# EAGLE design untitled (EAGLE 9.5.2)
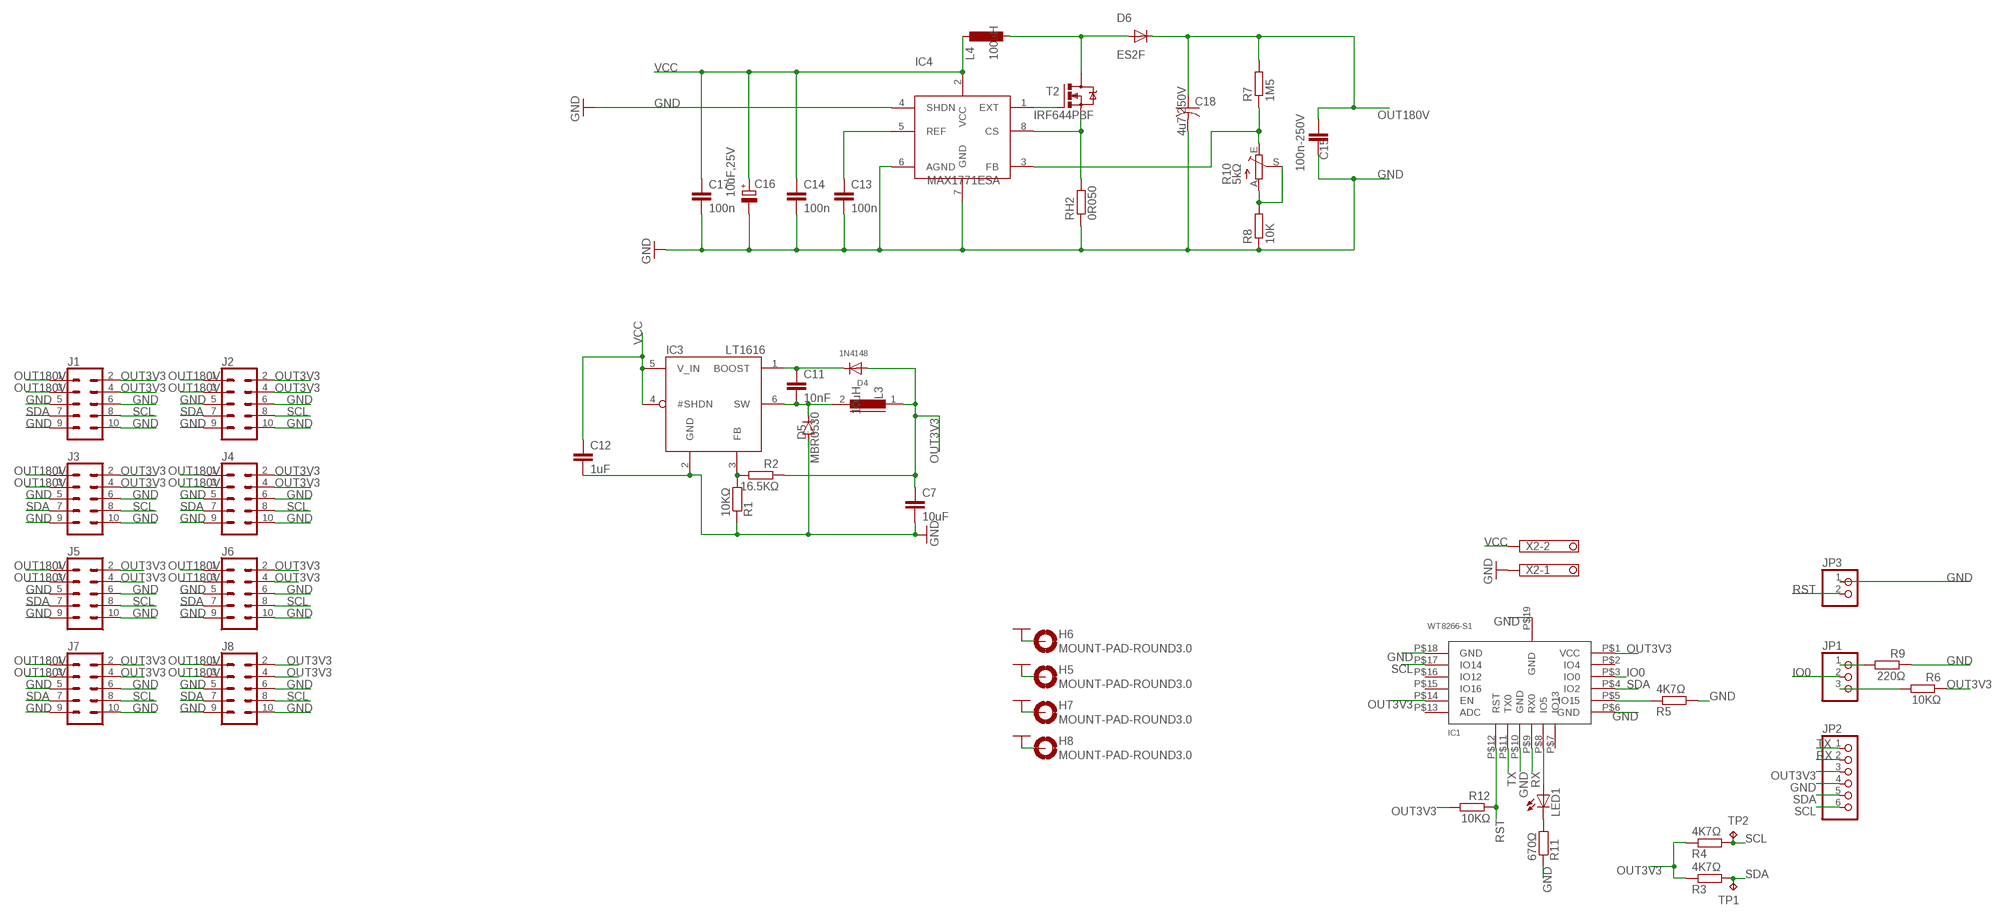
[diagram p0: schematic, sheet 1]

## Parts
C7  10uF  C-EUC1206  [C1206]
C11  10nF  C-EUC1206  [C1206]
C12  1uF  C-EUC1206  [C1206]
C13  100n  C-EUC1206  [C1206]
C14  100n  C-EUC1206  [C1206]
C15  100n-250V  C-EU-2420  [C2420]
C16  10uF,25V  C-POL-EU7343  [C-EIA-7343]
C17  100n  C-EUC1206  [C1206]
C18  4u7 250V  ECA-1EM102  [CAP_RADIAL_5MM]
D4  1N4148  DIODEDO-1N4148  [DO-1N4148]
D5  MBR0530  DIODE-SOD123  [SOD123]
D6  ES2F  DIODE-SMC  [SMC]
H5  MOUNT-PAD-ROUND3.0  [3,0-PAD]
H6  MOUNT-PAD-ROUND3.0  [3,0-PAD]
H7  MOUNT-PAD-ROUND3.0  [3,0-PAD]
H8  MOUNT-PAD-ROUND3.0  [3,0-PAD]
IC1  WT8266-S1  [WT8266-S1]
IC3  LT1616  [SOT23-6]
IC4  MAX1771ESA  [SO-8]
J1  CONN_05X2PTH  [2X5]
J2  CONN_05X2PTH  [2X5]
J3  CONN_05X2PTH  [2X5]
J4  CONN_05X2PTH  [2X5]
J5  CONN_05X2PTH  [2X5]
J6  CONN_05X2PTH  [2X5]
J7  CONN_05X2PTH  [2X5]
J8  CONN_05X2PTH  [2X5]
JP1  PINHD-1X3  [1X03]
JP2  PINHD-1X6  [1X06]
JP3  PINHD-1X2  [1X02]
L3  10uH  82114R  [82114R]
L4  100uH  L-EUTJ3-U1  [TJ3-U1]
LED1  LED3MM  [LED3MM]
R1  10KΩ  R-EU_R1206  [R1206]
R2  16.5KΩ  R-EU_R0805  [R0805]
R3  4K7Ω  R-EU_R1206  [R1206]
R4  4K7Ω  R-EU_R1206  [R1206]
R5  4K7Ω  R-EU_R1206  [R1206]
R6  10KΩ  R-EU_R1206  [R1206]
R7  1M5  R-EU_R2512  [R2512]
R8  10K  R-EU_R1206  [R1206]
R9  220Ω  R-EU_R1206  [R1206]
R10  5kΩ  TRIM_EU-RS3  [RS3]
R11  670Ω  R-EU_R1206  [R1206]
R12  10KΩ  R-EU_R1206  [R1206]
RH2  0R050  R-EU_R2512  [R2512]
T2  IRF644PBF  IRF740  [TO220BV]
TP1  TPTP18R  [TP18R]
TP2  TPTP18R  [TP18R]
X2  TERMINAL-BLOCK-3.5MM-2-PIN-LONG-PAD  [TERMINAL-BLOCK-2-PIN-3.5MM-LONG-PAD]

## Nets
EXT1: IC4.1(EXT) T2.G
GND: C7.2 C12.2 C13.2 C14.2 C15.P$2 C16.- C17.2 C18.2 D5.A H5.B3,0(MOUNT) H6.B3,0(MOUNT) H7.B3,0(MOUNT) H8.B3,0(MOUNT) IC1.P$6(GND) IC1.P$10(GND) IC1.P$18(GND) IC1.P$19(GND) IC3.2(GND) IC4.4(SHDN) IC4.6(AGND) IC4.7(GND) J1.5 J1.6 J1.9 J1.10 J2.5 J2.6 J2.9 J2.10 J3.5 J3.6 J3.9 J3.10 J4.5 J4.6 J4.9 J4.10 J5.5 J5.6 J5.9 J5.10 J6.5 J6.6 J6.9 J6.10 J7.5 J7.6 J7.9 J7.10 J8.5 J8.6 J8.9 J8.10 JP2.4 JP3.1 R1.1 R5.2 R8.1 R9.1 R11.1 RH2.1 X2.1
IO0: IC1.P$3(IO0) JP1.2
N$1: IC3.3(FB) R1.2 R2.2
N$2: IC1.P$5(IO15) R5.1
N$3: JP1.1 R9.2
N$4: C11.2 D5.C IC3.6(SW) L3.2
N$5: C11.1 D4.C IC3.1(BOOST)
N$6: IC4.3(FB) R7.1 R10.E
N$7 [power]: D6.A L4.2 T2.D
N$8: JP1.3 R6.2
N$9: C13.1 IC4.5(REF)
N$10: R8.2 R10.A R10.S
N$11: IC4.8(CS) RH2.2 T2.S
N$12: IC1.P$8(IO5) LED1.A
N$13: LED1.K(C) R11.2
OUT3V3: C7.1 D4.A IC1.P$1(VCC) IC1.P$14(EN) J1.2 J1.4 J2.2 J2.4 J3.2 J3.4 J4.2 J4.4 J5.2 J5.4 J6.2 J6.4 J7.2 J7.4 J8.2 J8.4 JP2.3 L3.1 R2.1 R3.1 R4.1 R6.1 R12.2
OUT180V [power]: C15.P$1 C18.1 D6.C J1.1 J1.3 J2.1 J2.3 J3.1 J3.3 J4.1 J4.3 J5.1 J5.3 J6.1 J6.3 J7.1 J7.3 J8.1 J8.3 R7.2
RST: IC1.P$12(RST) JP3.2 R12.1
RX: IC1.P$9(RX0) JP2.2
SCL: IC1.P$17(IO14) J1.8 J2.8 J3.8 J4.8 J5.8 J6.8 J7.8 J8.8 JP2.6 R4.2 TP2.TP
SDA: IC1.P$4(IO2) J1.7 J2.7 J3.7 J4.7 J5.7 J6.7 J7.7 J8.7 JP2.5 R3.2 TP1.TP
TX: IC1.P$11(TX0) JP2.1
VCC: C12.1 C14.1 C16.+ C17.1 IC3.4(#SHDN) IC3.5(V_IN) IC4.2(VCC) L4.1 X2.2
Unconnected: IC1.P$2(IO4) IC1.P$7(IO13) IC1.P$13(ADC) IC1.P$15(IO16) IC1.P$16(IO12)

## Library data of the parts
C7 C11-C14 C17 = resistor:C-EU: CAPACITOR, European symbol
C15 = nick:C-EU
C16 = nick:C-POL-EU7343: Capacitor, Tantalum, EU 7343 case, polarised
C18 = Resistor_Capacitor:ECA-1EM102: CAP ALUM 1000UF 20% 25V RADIAL Manufacturer's datasheet <https://media.digikey.com/pdf/Data%20Sheets/Panasonic%20Electronic%20Components/ECA-xxM%20Series,TypeA.pdf>; CREATED_BY: PCBLayout.com; DIGIKEY_PART_NUMBER: P5156-ND; MANUFACTURER: Panasonic Electronic Components; MPN: ECA-1EM102; PACKAGE: CAP RADIAL 5MM LS
D4 = adafruit:DIODE: Diode SMADIODE - SMA Surface Mount Package 20V 1A Schottky Diode Digikey: 641-1014-6-ND DO-1N4148 - Through Hole Small Current Diode SOD-123 20V 1 A (.5mV Vf) Schottky Diode - Digikey: MBRX120TPMSCT-ND SOD-323 10V 570mA (.38mV Vf, 3ns) Schottky Diode - Digikey: ZLLS410CT-ND SOD-523 30V 30mA Schottky Diode (RB751S-40TE61) - Digikey: RB751S-40TE61CT-ND SOT23-R/W - SOT23 Package (R = Solder Paste/Reflow Ovens, W = Hand-Soldering) BAT54Film 40V 300mA - Digikey: 497-7162-1-ND
D5 D6 = diode:DIODE-: DIODE
H5-H8 = holes:MOUNT-PAD-ROUND: MOUNTING PAD, round
IC1 = WT8266:WT8266-S1: WT8266-S1 WiFi Module
IC3 = ltc_swr:LT1616: LT1616 - 600mA, 1.4MHz Step-Down Switching Regulator in SOT-23 Wide Input Range: 3.6V to 25V 5V at 400mA from7V to 25V Input 3.3V at 400mA from 4.7V to 25V Input Fixed Frequency 1.4MHz Operation Uses Tiny Capacitors and Inductors Internally Compensated Low Shutdown Current: <1µA Low VCESAT Switch: 220mV at 300mA Tiny 6-Lead SOT-23 Package
IC4 = nick:MAX1771
J1-J8 = SparkFun-Connectors:CONN_05X2: Multi connection point. Often used as Generic Header-pin footprint for 0.1 inch spaced/style header connections For AVR SPI programming port, see special device with nice symbol: "AVR_SPI_PROG_5x2.dev" You can populate with any combo of single row headers, but if you'd like an exact match, check these: 2x5 AVR ICSP Male Header <https://www.sparkfun.com/products/778> (PRT-00778) 2x5 Pin Shrouded Header <https://www.sparkfun.com/products/8506> (PRT-08506) On any of the 0.1 inch spaced packages, you can populate with these: Break Away Headers - Straight <https://www.sparkfun.com/products/116> (PRT-00116) Break Away Male Headers - Right Angle <https://www.sparkfun.com/products/553> (PRT-00553) Female Headers <https://www.sparkfun.com/products/115> (PRT-00115) Break Away Headers - Machine Pin <https://www.sparkfun.com/products/117> (PRT-00117) Break Away Female Headers - Swiss Machine Pin <https://www.sparkfun.com/products/743> (PRT-00743) Special note: the shrouded connector mates well with our 5x2 ribbon cables: 2x5 Pin IDC Ribbon Cable <https://www.sparkfun.com/products/8535> (PRT-08535); PROD_ID: CONN-08499; SF_ID: PRT-0778
JP1 = pinhead:PINHD-1X3: PIN HEADER
JP2 = pinhead:PINHD-1X6: PIN HEADER
JP3 = pinhead:PINHD-1X2: PIN HEADER
L3 = inductors:82114R: INDUCTOR; SPICEPREFIX: L
L4 = rcl:L-EU: INDUCTOR, European symbol; SPICEPREFIX: L
LED1 = adafruit:LED: LED OSRAM: - CHIPLED LG R971, LG N971, LY N971, LG Q971, LY Q971, LO R971, LY R971 LH N974, LH R974 LS Q976, LO Q976, LY Q976 LO Q996 - Hyper CHIPLED LW Q18S LB Q993, LB Q99A, LB R99A - SideLED LS A670, LO A670, LY A670, LG A670, LP A670 LB A673, LV A673, LT A673, LW A673 LH A674 LY A675 LS A676, LA A676, LO A676, LY A676, LW A676 LS A679, LY A679, LG A679 - Hyper Micro SIDELED® LS Y876, LA Y876, LO Y876, LY Y876 LT Y87S - SmartLED LW L88C, LW L88S LB L89C, LB L89S, LG L890 LS L89K, LO L89K, LY L89K LS L896, LA L896, LO L896, LY L896 - TOPLED LS T670, LO T670, LY T670, LG T670, LP T670 LSG T670, LSP T670, LSY T670, LOP T670, LYG T670 LG T671, LOG T671, LSG T671 LB T673, LV T673, LT T673, LW T673 LH T674 LS T676, LA T676, LO T676, LY T676, LB T676, LH T676, LSB T676, LW T676 LB T67C, LV T67C, LT T67C, LS T67K, LO T67K, LY T67K, LW E67C LS E67B, LA E67B, LO E67B, LY E67B, LB E67C, LV E67C, LT E67C LW T67C LS T679, LY T679, LG T679 LS T770, LO T770, LY T770, LG T770, LP T770 LB T773, LV T773, LT T773, LW T773 LH T774 LS E675, LA E675, LY E675, LS T675 LS T776, LA T776, LO T776, LY T776, LB T776 LHGB T686 LT T68C, LB T68C - Hyper Mini TOPLED® LB M676 - Mini TOPLED Santana® LG M470 LS M47K, LO M47K, LY M47K Source: http://www.osram.convergy.de/
R1-R6 R9 R11 R12 RH2 = resistor:R-EU_: RESISTOR, European symbol
R7 = rcl:R-EU_: RESISTOR, European symbol
R8 = rcl:R-EU_: RESISTOR, European symbol; SPICEPREFIX: R
R10 = pot:TRIM_EU-: POTENTIOMETER
T2 = transistor-power:IRF740: N-CHANNEL MOS FET
TP1 TP2 = testpad:TP: Test pad
X2 = Rembrandt Electronics - Terminal Block 3-5mm v1-0:TERMINAL-BLOCK-3.5MM-2-PIN: Terminal Block 3.5mm Pitch: 3,5 mm Number of pins: 2 Created by Rembrandt Electronics www.rembrandtelectronics.com

## Net classes
1 power: width 0.762 mm, clearance 0.508 mm

## Board
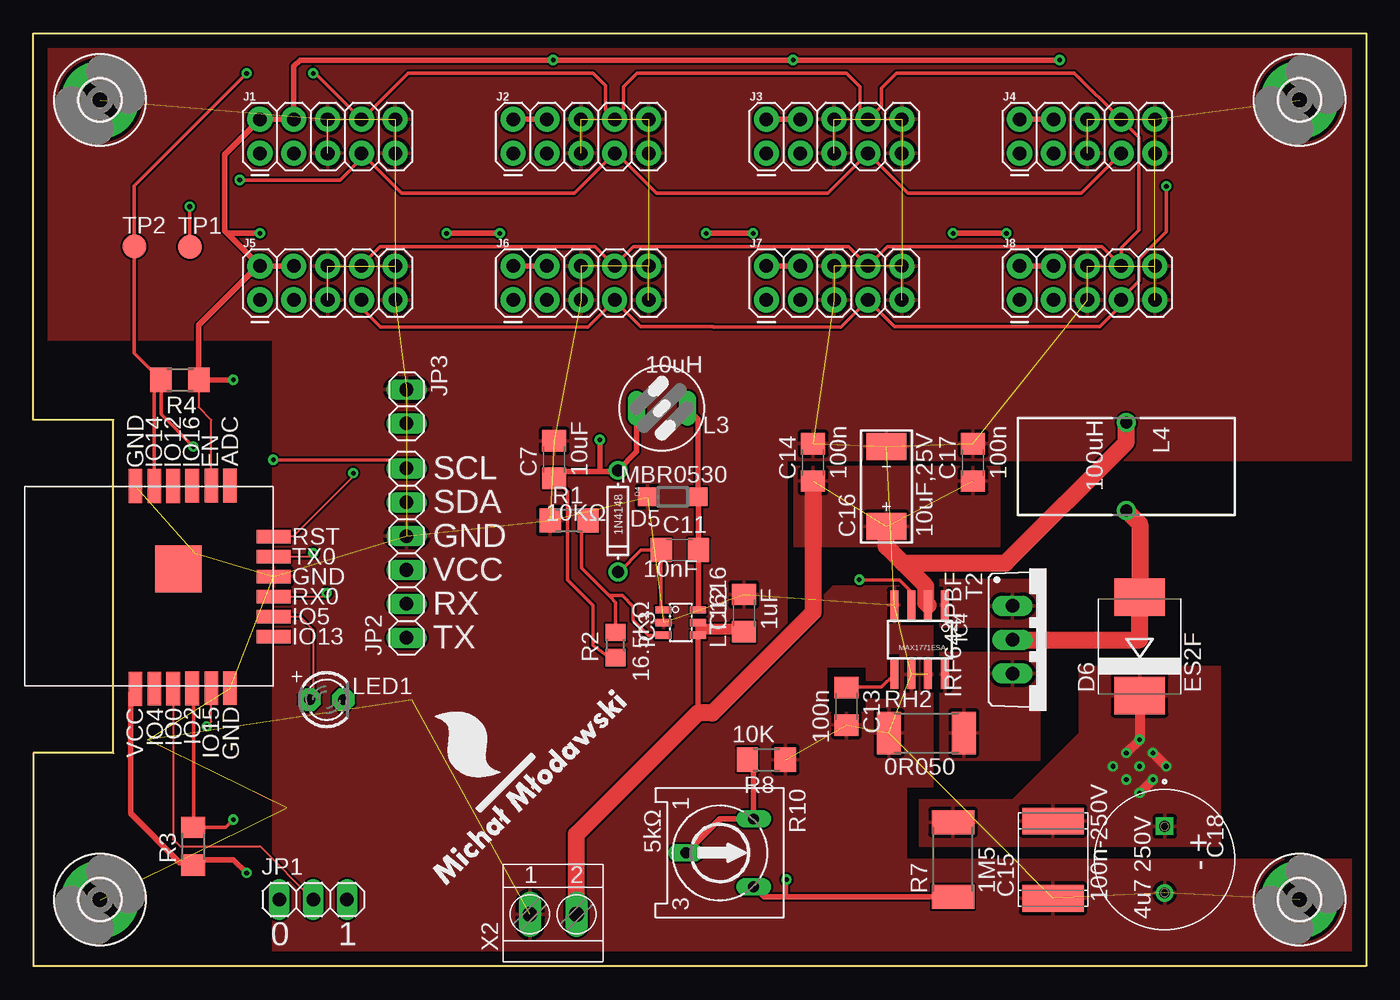
[diagram p1: board, top side]
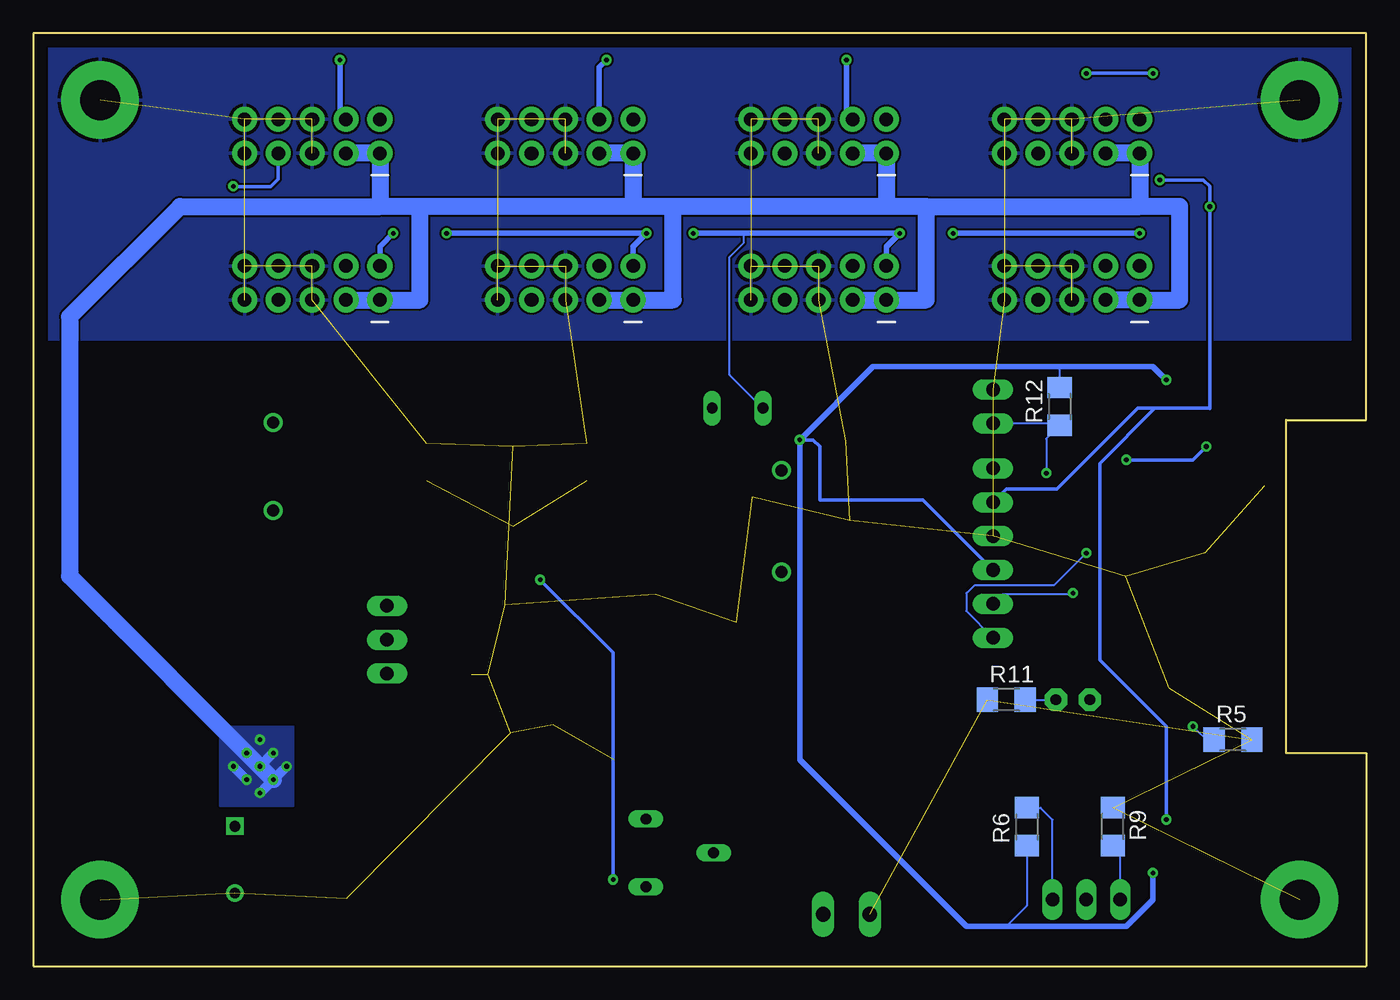
[diagram p2: board, bottom side, seen from below]

Size 100 x 70 mm. Coordinates in mm from the lower left corner, seen from the top.
Outline: 0,70 100,70 100,0 0,0 0,16 6,16 6,41 0,41 0,70
Copper layers (1*16): Top 0.035mm / dielectric 1.5mm / Bottom 0.035mm
Design rules "default": minimum track width 6mil, minimum drill 0.35mm, track to track 6mil, track to pad 6mil, pad to pad 6mil, via to via 6mil, smd to smd 6mil, copper to edge 40mil, drill to drill 6mil, minimum pad ring 10mil, minimum via ring 8mil, stop-mask expansion 4mil, vias tented up to drill 0mil, thermal gap 10mil

### Footprints (pad centres in the part's own frame; a part is rotated, then mirrored left to right if it is on the bottom)
C1206 = smd 1.6 x 1.8: 1 -1.4,0; 2 1.4,0
C2420 = smd 2 x 4.6: P$1 2.9,0; P$2 -2.9,0
C-EIA-7343 = smd 2 x 3: + -3,0; - 3,0
CAP_RADIAL_5MM = drill 0.8 pad 1.2 square: 1 -2.5,0 | drill 0.8 pad 1.2: 2 2.5,0
DO-1N4148 = drill 0.9: A -3.81,0; C 3.81,0
SOD123 = smd 1.4 x 1.4: A 1.9,0; C -1.9,0
SMC = smd 2.8 x 3.8: A 3.7,0; C -3.7,0
3,0-PAD = drill 3 pad 5.842: B3,0 0,0
WT8266-S1 = smd 2.54 x 1.02: P$1 -0.18,10.35; P$2 -0.17,8.92; P$3 -0.17,7.51; P$4 -0.15,6.08; P$5 -0.14,4.65; P$6 -0.14,3.24; P$13 15.06,3.24; P$14 15.06,4.65; P$15 15.05,6.08; P$16 15.03,7.51; P$17 15.03,8.92; P$18 15.02,10.35 | smd 1.02 x 2.54: P$7 3.73,-0.02; P$8 5.23,-0.02; P$9 6.73,-0.02; P$10 8.23,-0.02; P$11 9.73,-0.02; P$12 11.23,-0.02 | smd 3.51 x 3.49: P$19 8.8,7.1
SOT23-6 = smd 0.55 x 1.2: 1 -0.95,-1.3; 2 0,-1.3; 3 0.95,-1.3; 4 0.95,1.3; 5 0,1.3; 6 -0.95,1.3
SO-8 = smd 0.6 x 2.2: 1 -1.905,-2.6; 2 -0.635,-2.6; 3 0.635,-2.6; 4 1.905,-2.6; 5 1.905,2.6; 6 0.635,2.6; 7 -0.635,2.6; 8 -1.905,2.6
2X5 = drill 1.016 pad 1.88: 1 0,0; 2 0,2.54; 3 2.54,0; 4 2.54,2.54; 5 5.08,0; 6 5.08,2.54; 7 7.62,0; 8 7.62,2.54; 9 10.16,0; 10 10.16,2.54
1X03 = drill 1.016 long: 1 -2.54,0; 2 0,0; 3 2.54,0
1X06 = drill 1.016 long: 1 -6.35,0; 2 -3.81,0; 3 -1.27,0; 4 1.27,0; 5 3.81,0; 6 6.35,0
1X02 = drill 1.016 long: 1 -1.27,0; 2 1.27,0
82114R = drill 0.813 long: 1 0,1.905; 2 0,-1.905
TJ3-U1 = drill 0.9: 1 -3.3,0; 2 3.3,0
LED3MM = drill 0.813 pad 1.676 octagon: A -1.27,0; K 1.27,0
R1206 = smd 1.6 x 1.803: 1 -1.422,0; 2 1.422,0
R0805 = smd 1.3 x 1.5: 1 -0.95,0; 2 0.95,0
R2512 = smd 1.8 x 3.2: 1 -2.8,0; 2 2.8,0
RS3 = drill 0.813 long: A -2.54,2.54; E 2.54,2.54; S 0,-2.54
TO220BV = drill 1.016 long: D 0,-2.54; G -2.54,-2.54; S 2.54,-2.54
TP18R = smd 1.8 x 1.8: TP 0,0
TERMINAL-BLOCK-2-PIN-3.5MM-LONG-PAD = drill 1.1 pad 1.7 long: 1 -1.75,-0.1; 2 1.75,-0.1

### Placement (x,y rotation side)
C7  39.07,38.02 90 top
C11  48.5,31.22 0 top
C12  53.31,26.5 90 top
C13  61,19.5 270 top
C14  58.5,37.8 90 top
C15  76.5,8 90 top
C16  64,36 90 top
C17  70.5,37.8 90 top
C18  84.88,8 270 top
D4  43.86,33.4 270 top
D5  47.98,35.22 180 top
D6  83,24 90 top
H5  95,65 0 top
H6  5,5 0 top
H7  95,5 0 top
H8  5,65 0 top
IC1  18,21 90 top
IC3  48.58,25.78 270 top
IC4  66.5,24.5 180 top
J1  17,61 0 top
J2  36,61 0 top
J3  55,61 0 top
J4  74,61 0 top
J5  17,50 0 top
J6  36,50 0 top
J7  55,50 0 top
J8  74,50 0 top
JP1  21,5 0 top
JP2  28,31 90 top
JP3  28,42 270 top
L3  47.16,41.87 90 top
L4  82,37.5 270 top
LED1  22,20 0 top
R1  40.2,33.43 0 top
R2  43.69,24.1 90 top
R3  12,9 90 top
R4  11,44 180 top
R5  10,17 0 bottom
R6  25.46,10.47 90 bottom
R7  69,8 90 top
R8  55,15.5 180 top
R9  19.02,10.47 270 bottom
R10  51.5,8.5 270 top
R11  27,20 0 bottom
R12  23,42 90 bottom
RH2  67,17.5 0 top
T2  76,24.5 270 top
TP1  11.74,53.98 0 top
TP2  7.57,54 0 top
X2  39,4 0 top

### Tracks (layer width: path | path; a pad name or v marks a point on that pad's centre or on a via)
EXT1
  pour Top: 75.5,29 68,29 68,25.5 75.5,25.5
GND  (61 unrouted)
  Top 0.152: 46.09,35.23 D5.A | 53.33,27.91 C12.2 | IC1.P$19 12.1,31
  Top 1.27: IC1.P$19 11,29.7
  pour Top: 56.5,47 56.5,0 18,0 18,47
  pour Top: 44.44,38 100,38 100,47 44.44,47
  pour Top: 44,0 100,0 100,8 44,8
  pour Top: 67.5,24.5 65,24.5 65,20 62.5,20 62.5,19 56.5,19 56.5,8 65.5,8 65.5,13.5 67.5,13.5
  pour Top: 65,25.5 65,28.5 60,28.5 44,12.5 44,8 59.5,8 59.5,22.5 62.5,22.5 62.5,21.5 64,21.5 64,23.5 67.5,23.5 67.5,25.5
  pour Top: 100,70 100,47 0,47 0,70
  pour Bottom: 0,70 0,47 100,47 100,70
IO0
  Top 0.152: JP1.2 17,9 11,9 10.49,9.51 IC1.P$3
N$1
  Top 0.254: R2.2 43.69,27.31 43.25,27.75 | 43.25,27.75 41.12,29.88 41.12,32.93 R1.2 | IC3.3 46.17,24.83 45,26 45,27 44.19,27.81 43.31,27.81 43.25,27.75
N$2  (via drill 0.35)
  Top 0.152: v13,18 13.35,18.35 IC1.P$5
  Bottom 0.152: v13,18 11.71,16.71 R5.1
N$3
  Bottom 0.152: JP1.1 18.46,8.49 R9.2
N$4
  Top 0.254: IC3.6 49.9,26.75 | D5.C 49.9,35.2
  Top 0.406: 49.9,26.75 C11.2 49.9,35.2 | D5.C 49.88,41.05 L3.2
N$5
  Top 0.254: IC3.1 47.1,26.91 C11.1 45.6,31.22 43.97,29.59 D4.C
N$6  (via drill 0.35)
  Top 0.254: IC4.3 65.86,28.1 64.97,29 v61.97,29 | v56.5,6.5 56.5,5.2
  Top 0.406: R7.1 56.5,5.2 54.8,5.2 R10.E
  Bottom 0.254: v61.97,29 56.5,23.53 v56.5,6.5
N$7
  Top 1.27: L4.2 83,33.2 D6.A 83,24.5 T2.D
N$8
  Bottom 0.152: R6.2 24.44,11.9 23.54,11 JP1.3
N$9
  Top 0.152: C13.1 61.05,20.95
  Top 0.254: IC4.5 63.64,20.95 61.05,20.95
N$10
  Top 0.406: R8.2 54.04,15.04 R10.A 51.5,11.04 R10.S
N$11
  pour Top: 75.5,23.5 68,23.5 68,15.5 75.5,15.5
N$12
  Top 0.152: IC1.P$8 20.02,26.23 21,25.25 21,20.27 LED1.A
N$13
  Bottom 0.152: R11.2 LED1.K
OUT3V3  (via drill 0.35)
  Top 0.152: R4.1 12.41,44.07 12.41,41.94 13.35,41 IC1.P$14 | 16.83,52.53 J5.2
  Top 0.254: 39.57,37.12 C7.1 40.07,35.62 40.07,29 42,27.07 42,24.07 43.27,23.15 R2.1 | 43.77,37.12 D4.A
  Top 0.406: L3.1 45.26,38.61 D4.A | 39.57,37.12 42.5,37.12 | 42.5,37.12 43.77,37.12 | IC1.P$1 7.3,20.46 7.3,14.71 7.31,14.69 7.31,11.46 11,7.77 11.81,7.77 R3.1 | R3.1 11.55,8.03 | R3.1 12.42,8 15,8 v16,7 | J5.4 J5.2 14.54,55 | J6.2 J6.4 | J7.2 J7.4 | J8.2 J8.4 | J4.4 J4.2 | J3.4 J3.2 | J2.4 J2.2 | v77,68 v57,68 v39,68 20,68 19.54,67.54 J1.4 J1.2 14.35,60.89 14.35,55.19 14.54,55 | v69,55 v73,55 | v31,55 v35,55 | v50.48,55 v54,55 | v17,55 14.54,55 | 16.83,52.53 12.41,48.11 12.41,44.07 12.48,44 v15,44 | 42.5,37.12 v42.5,39.5
  Bottom 0.152: 46.7,55 46.7,54.28 47.76,53.21 47.76,44.38 45.33,41.94 L3.1 | R6.1 25.46,4.54 27,3 | R12.2 23,45
  Bottom 0.254: JP2.3 33.27,35 41,35 41,39 41.5,39.5 v42.5,39.5
  Bottom 0.406: v16,7 16,5 18,3 27,3 30,3 42.5,15.5 v42.5,39.5 37,45 23,45 16,45 v15,44 | v77,68 77,64 J4.4 | v57,68 57.54,67.46 J3.4 | v39,68 39,64 J2.4 | v17,55 v31,55 | v50.48,55 46.7,55 v35,55 36,54 J6.2 | v69,55 v54,55 55,54 J7.2 | v73,55 74,54 J8.2
OUT180V  (via drill 0.35)
  Top 0.762: D6.C v83,17 v82,16 | v84,16 v85,15 | v84,14 v83,13
  Bottom 0.762: v82,16 v83,15 v82,14 | v85,15 v84,14 | v83,13 v82,14 | v82,14 v81,15
  Bottom 1.27: v82,14 97.27,29.27 97.27,48.73 89,57 74,57 | J8.3 J8.1 71,50 71,57 | J7.3 J7.1 52,50 52,57 | J6.3 J6.1 33,50 33,57 | J2.3 J2.1 36,57 | J3.3 J3.1 55,57 | J4.3 J4.1 74,57 | J1.3 J1.1 17,57 | 33,57 17,57 | 33,57 36,57 | 36,57 52,57 | 52,57 55,57 | 55,57 71,57 | 71,57 74,57 | J5.3 J5.1 14,50 14,57 17,57
  pour Top: 66.5,12.5 73.5,12.5 78.5,17.5 78.5,22.5 89,22.5 89,9 66.5,9
  pour Bottom: 86,18 80.5,18 80.5,12 86,12
RST  (via drill 0.35)
  Top 0.152: IC1.P$12 19.5,32.23 24,36.73 v24,37
  Bottom 0.152: JP3.2 23.15,40.73 R12.1 24,39.58 v24,37
RX  (via drill 0.35)
  Top 0.152: IC1.P$9 21.73,27.73 v22,28
  Bottom 0.152: v22,28 22.11,27.89 27.3,27.89 JP2.2
SCL  (via drill 0.35)
  Top 0.152: 9.08,43.5 R4.2
  Top 0.254: IC1.P$17 9.08,43.5 | v16,67 7.58,58.58 TP2.TP | TP2.TP 7.58,46 R4.2 9.58,41.42 v12,39 | v21,67 21.14,67 24.6,63.54 J1.8 24.65,63.54 28.12,67.01 41.99,67.01 42.94,66.06 42.94,64.22 J2.8 43.62,63.67 44.29,64.34 44.29,65.98 45.31,67 61,67 62,66 62,64.16 J3.8 63.62,64.54 63.62,65.87 64.75,67 78.12,67 81.58,63.54 J4.8 82.94,62.22 82.94,60.49 82.94,55.24 81.62,53.92 J8.8 80.16,54 64.09,54 62.63,52.54 J7.8 61.16,54 45.04,54 43.62,52.58 J6.8 42.16,54 26,54 24.62,52.62 J5.8 | TP2.TP | JP2.6 27.35,38 v18,38
  Bottom 0.254: v21,67 v16,67 | v12,39 13,38 v18,38
SDA  (via drill 0.35)
  Top 0.152: 12.02,20.75 11.95,20.83 IC1.P$4 | 12.02,10.49 R3.2
  Top 0.254: 12.02,20.75 12.02,10.49 | R3.2 14.42,10.42 v15,11 | J4.7 78.62,58 65.62,58 J3.7 59.62,58 46.76,58 43.76,61 J2.7 40.62,58 27.62,58 J1.7 24.62,60.62 23,59 v15.48,59 | v85,58.52 85,55.1 82.94,53.05 82.94,51.4 81.62,50.08 J8.7 81.62,49.62 80,48 64.61,48 J7.7 62.62,49.97 60.61,47.96 51.04,47.96 51,48 45.56,48 43.62,49.94 J6.7 43.62,49.94 41.63,47.96 26.04,47.96 24.62,49.38 J5.7 | v11.73,57 TP1.TP
  Bottom 0.254: 11.73,41.83 11.73,42 | 11.73,42 v11.73,57 11.73,58.53 12.2,59 v15.48,59 | J4.7 81.62,59.06 82.18,58.5 84.98,58.5 v85,58.52 | 11.73,42 11.86,41.86 15.86,41.86 | 15.86,41.86 20,37.73 20,23 15,18 v15,11 | JP2.5 27,35.81 23.19,35.81 17.14,41.86 15.86,41.86
TX  (via drill 0.35)
  Top 0.152: IC1.P$11 20.73,30.73 v21,31
  Bottom 0.152: v21,31 23.42,28.58 29.39,28.58 29.97,28 30,28 30,26.65 JP2.1
VCC  (2 unrouted)
  Top 0.406: IC3.5 49.88,25.5 | IC3.4 49.88,25.5 | 49.88,25.5 52.91,25.5 C12.1 50.15,25.1 IC3.4 | IC3.4 49.88,19.03 49.85,19
  Top 1.27: C16.+ 64,31.48 65.24,30.24 | C14.1 58.5,26.55 50.95,19 49.85,19 40.75,9.9 X2.2 | L4.1 82,39.3 72.94,30.24 65.24,30.24 | IC4.2 66.95,27.28 66.95,28.53 65.24,30.24
  pour Top: 57.06,37.5 57.06,31.5 72.5,31.5 72.5,37.5

### Text on the board
tPlace: SCL | SDA | GND | VCC | RX | TX | + | - | 0 | 1